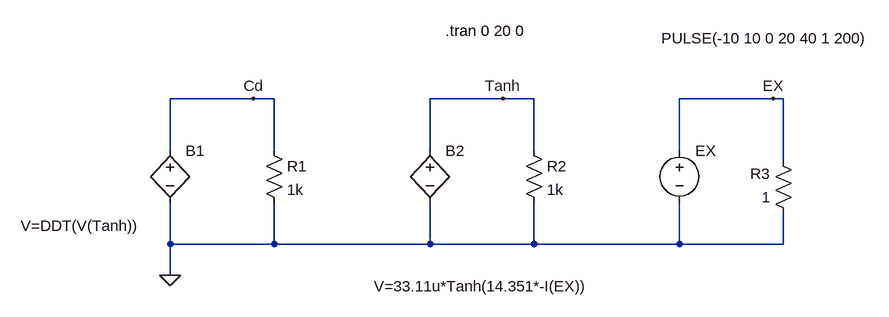
[diagram p0: schematic sby_tanh.asc]
sby_tanh.asc, the LTspice schematic file:
Version 4
SHEET 1 948 680
WIRE -176 -176 -304 -176
WIRE -144 -176 -176 -176
WIRE 208 -176 96 -176
WIRE 256 -176 208 -176
WIRE 624 -176 480 -176
WIRE 640 -176 624 -176
WIRE -304 -96 -304 -176
WIRE -144 -96 -144 -176
WIRE 96 -96 96 -176
WIRE 256 -96 256 -176
WIRE 480 -96 480 -176
WIRE 640 -80 640 -176
WIRE -304 48 -304 -16
WIRE -144 48 -144 -16
WIRE -144 48 -304 48
WIRE 96 48 96 -16
WIRE 96 48 -144 48
WIRE 256 48 256 -16
WIRE 256 48 96 48
WIRE 480 48 480 -16
WIRE 480 48 256 48
WIRE 640 48 640 0
WIRE 640 48 480 48
WIRE -304 96 -304 48
FLAG -304 96 0
FLAG -176 -176 Cd
FLAG 624 -176 EX
FLAG 208 -176 Tanh
SYMBOL bv -304 -112 R0
WINDOW 3 -230 132 Left 2
SYMATTR Value V=DDT(V(Tanh))
SYMATTR InstName B1
SYMBOL bv 96 -112 R0
WINDOW 3 -86 225 Left 2
SYMATTR Value V=33.11u*Tanh(14.351*-I(EX))
SYMATTR InstName B2
SYMBOL voltage 480 -112 R0
WINDOW 3 -28 -157 Left 2
WINDOW 123 0 0 Left 0
WINDOW 39 0 0 Left 0
SYMATTR Value PULSE(-10 10 0 20 40 1 200)
SYMATTR InstName EX
SYMBOL res -160 -112 R0
SYMATTR InstName R1
SYMATTR Value 1k
SYMBOL res 240 -112 R0
SYMATTR InstName R2
SYMATTR Value 1k
SYMBOL res 656 16 R180
WINDOW 0 36 76 Left 2
WINDOW 3 36 40 Left 2
SYMATTR InstName R3
SYMATTR Value 1
TEXT 120 -280 Left 2 !.tran 0 20 0

The netlist it stands for:
* sby_tanh.asc
B1 Cd 0 V=DDT(V(Tanh))
B2 Tanh 0 V=33.11u*Tanh(14.351*-I(EX))
V§EX EX 0 PULSE(-10 10 0 20 40 1 200)
R1 Cd 0 1k
R2 Tanh 0 1k
R3 0 EX 1
.tran 0 20 0
.backanno
.end